# Altium project TPS54561_Buck_HV.PrjPcb
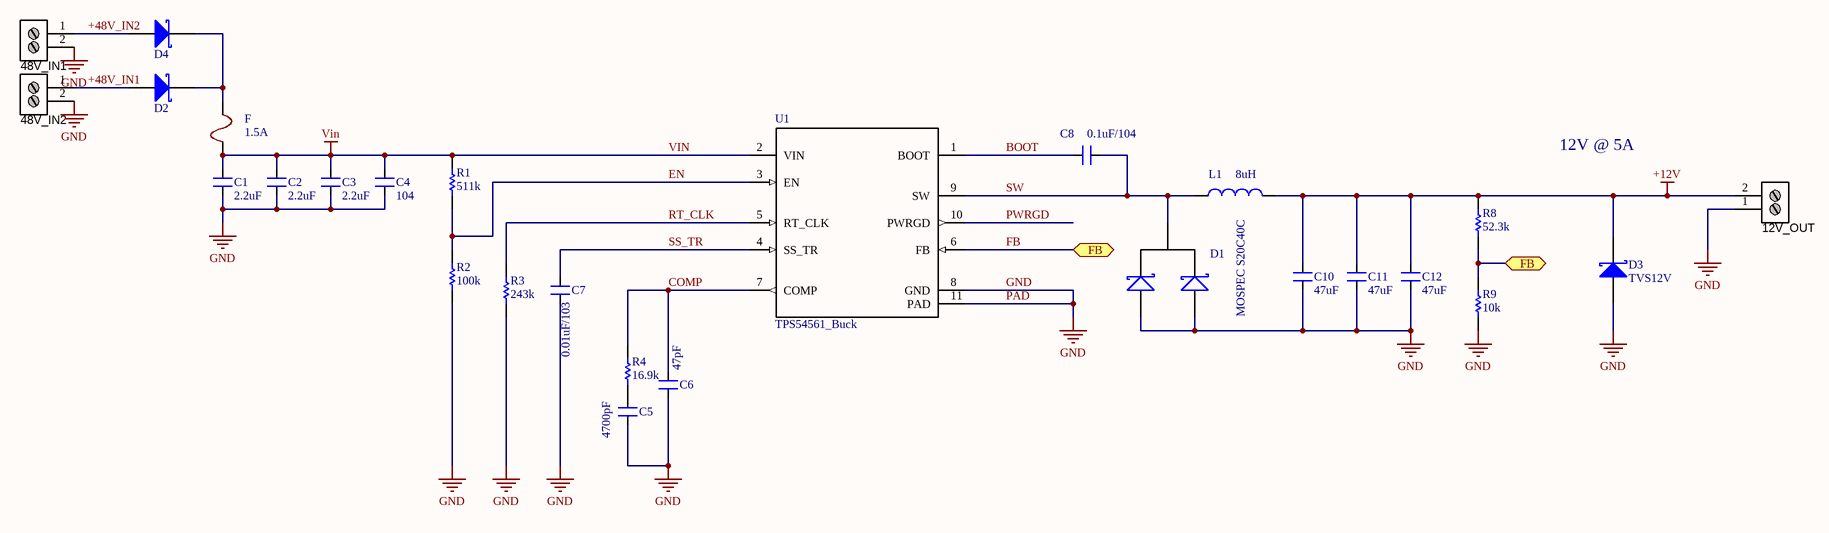
[diagram p0: TPS54561_Buck_HV.SchDoc]
1 sheet, 27 parts. Net scope: flat (ports and power ports of the same name join across sheets).
Board file: TPS54561_Buck_HV.PcbDoc

## Sheet TPS54561_Buck_HV.SchDoc
size A3

### Parts
12V_OUT  Stackable ScrewTerm  [2P_PCB_ScrewTerm_200mil]  (value not drawn)
48V_IN1  Stackable ScrewTerm  [2P_PCB_ScrewTerm_200mil]  (value not drawn)
48V_IN2  Stackable ScrewTerm  [2P_PCB_ScrewTerm_200mil]  (value not drawn)
C1  value 2.2uF  [CAPC3225N]  (hidden comment: CAP NP)
C2  value 2.2uF  [CAPC3225N]  (hidden comment: CAP NP)
C3  value 2.2uF  [CAPC3225N]  (hidden comment: CAP NP)
C4  value 104  [CAPC1608N]  (hidden comment: CAP NP)
C5  value 4700pF  [CAPC2012N]  (hidden comment: CAP NP)
C6  value 47pF  [CAPC2012N]  (hidden comment: CAP NP)
C7  value 0.01uF/103  [CAPC2012N_F]  (hidden comment: CAP NP)
C8  value 0.1uF/104  [CAPC1608N_F]  (hidden comment: CAP NP)
C10  value 47uF  [CAPC3225N]  (hidden comment: CAP NP)
C11  value 47uF  [CAPC3225N]  (hidden comment: CAP NP)
C12  value 47uF  [CAPC3225N]  (hidden comment: CAP NP)
D1  MOSPEC S20C40C  [TO-220]
D2  (no value)  [DO-214AC]
D3  TVS12V  [DO-214AA]
D4  SS14  [DO-214AC]  (value not drawn)
F  1.5A  [FUSE_SR-5-BK]
L1  value 8uH  [Toroid]  (hidden comment: Inductor)
R1  value 511k  [RESC2012N]  (hidden comment: Res)
R2  value 100k  [RESC2012N]  (hidden comment: Res)
R3  value 243k  [RESC2012N_F]  (hidden comment: Res)
R4  value 16.9k  [RESC2012N]  (hidden comment: Res)
R8  value 52.3k  [RESC2012N]  (hidden comment: Res)
R9  value 10k  [RESC2012N]  (hidden comment: Res)
U1  TPS54561_Buck  [DPR0010A]

### Ports
FB

### Nets
+12V: 12V_OUT.2 C10.2 C11.2 C12.2 D3.2(K) L1.2 R8.2
GND: 12V_OUT.1 48V_IN1.2 48V_IN2.2 C1.1 C2.1 C3.1 C4.1 C5.1 C6.2 C7.2 C10.1 C11.1 C12.1 D1.1(A1) D1.3(K) D3.1(A) R2.1 R3.1 R9.1 U1.8(GND) U1.11(PAD)  [also labelled PAD]
VIN: C1.2 C2.2 C3.2 C4.2 F.1 R1.2 U1.2(VIN)
+48V_IN1: 48V_IN2.1 D2.1(A)
+48V_IN2: 48V_IN1.1 D4.1(A)
BOOT: C8.2 U1.1(BOOT)
COMP: C6.1 R4.2 U1.7(COMP)
EN: R1.1 R2.2 U1.3(EN)
FB: R8.1 R9.2 U1.6(FB) ; port FB
PWRGD: U1.10(PWRGD)
RT_CLK: R3.2 U1.5(RT_CLK)
SS_TR: C7.1 U1.4(SS_TR)
SW: C8.1 D1.2(A2) L1.1 U1.9(SW)
NetC5_2: C5.2 R4.1
NetD2_2: D2.2(K) D4.2(K) F.2

### Notes on the sheet
- 12V @ 5A

### Library data of the parts
12V_OUT 48V_IN1 48V_IN2 = 2P_ScrewTerm_90S_3.81MM: Terminal Block Screw Type THT 2-Position 3.81mm pitch; Manufacturer 1: Tyco Electronics; Manufacturer Part Number 1: 1776113-2; Value: 2 position; Pitch: 0.150" (3.81mm); Positions Per Level: 2; Package / Case: Side Entry; 3.81mm pitch; Category: Connectors Interconnects; Color: Black; Supplier 1: Digi-Key; Supplier Part Number 1: A97976-ND
D1 = Diode x2
D2-D4 = Diode Schottky: pin to pad: 1>A 2>K
F = Fuse